# Altium schematic sheet Channel.SchDoc
size A4; SheetNumber: 2; SheetTotal: 2
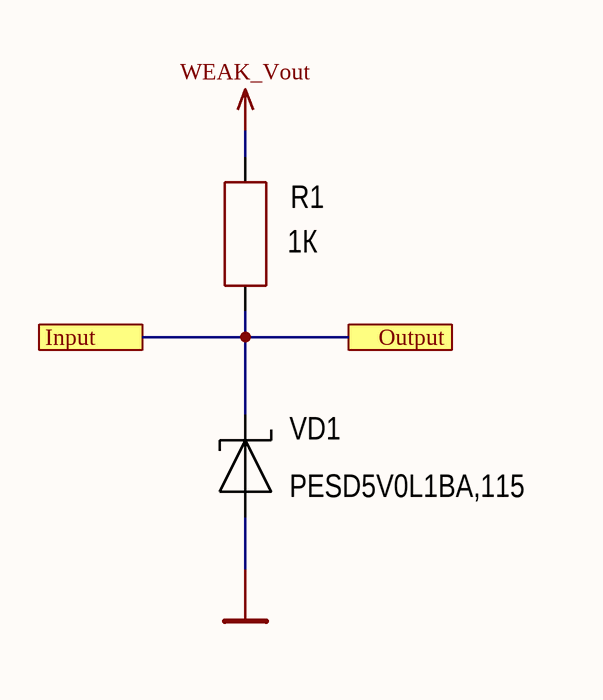
[diagram p0: Channel.SchDoc]

## Parts
R1  value 1К  [RES: 0805]
VD1  PartNumber: PESD5V0L1BA,115  [DIODE: SOD323]

## Ports
Input, Output

## Nets
GND: VD1.1
WEAK_Vout: R1.2
Input: R1.1 VD1.2 ; port Input, port Output

## Library data of the parts
R1 = Resistor_0805: Manufacturer: Yageo; PartNumber: RC0805JR-07100RL; ValueManufacturerPartNumber: Resistor film, 1К, ±5%, 0805, 0.125W, -55...+125°C; TypeResistor: Resistor film; Power: 0.125W; Tolerance: ±5%; Package: 0805; HelpURL: https://www.digikey.com/product-detail/en/yageo/RC0805JR-07100RL/311-100ARCT-ND/731185; Temperature: -55...+125°C
VD1 = Schottky_single: https://www.chipdip.ru/product/srr1208-330yl; Manufacturer: Diodes Incorporated; ValueManufacturerPartNumber: Schottky diode, 80V, 500mA, 1V, 15pF, SOD-123, -55...+150°C; TypeDiode: Schottky diode; Voltage: 80V; Current: 500mA; VoltageDrop: 1V; RecoveryTime: 15pF; Package: SOD-123; HelpURL: https://www.digikey.com/product-detail/en/diodes-incorporated/MBR0580S1-7/MBR0580S1-7DICT-ND/5080371; Temperature: -55...+150°C